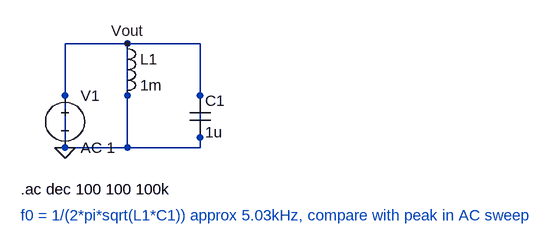
[diagram p0: schematic 05_LC_resonance.asc]
05_LC_resonance.asc, the LTspice schematic file:
Version 4
SHEET 1 880 680
WIRE 224 96 128 96
WIRE 336 96 224 96
WIRE 128 176 128 96
WIRE 224 176 224 96
WIRE 336 176 336 96
WIRE 128 256 128 176
WIRE 224 256 224 176
WIRE 224 256 128 256
WIRE 336 256 336 176
WIRE 336 256 224 256
FLAG 128 256 0
FLAG 224 96 Vout
SYMBOL voltage 128 160 R0
SYMATTR InstName V1
SYMATTR Value AC 1
SYMBOL ind 208 80 R0
SYMATTR InstName L1
SYMATTR Value 1m
SYMBOL cap 320 176 R0
SYMATTR InstName C1
SYMATTR Value 1u
TEXT 60 320 Left 2 !.ac dec 100 100 100k
TEXT 60 360 Left 2 ;f0 = 1/(2*pi*sqrt(L1*C1)) approx 5.03kHz, compare with peak in AC sweep

The netlist it stands for:
* 05_LC_resonance.asc
V1 0 0 AC 1
L1 0 0 1m
C1 0 0 1u
.ac dec 100 100 100k
* f0 = 1/(2*pi*sqrt(L1*C1)) approx 5.03kHz, compare with peak in AC sweep
.backanno
.end